# Altium project ET-master.PrjPCB
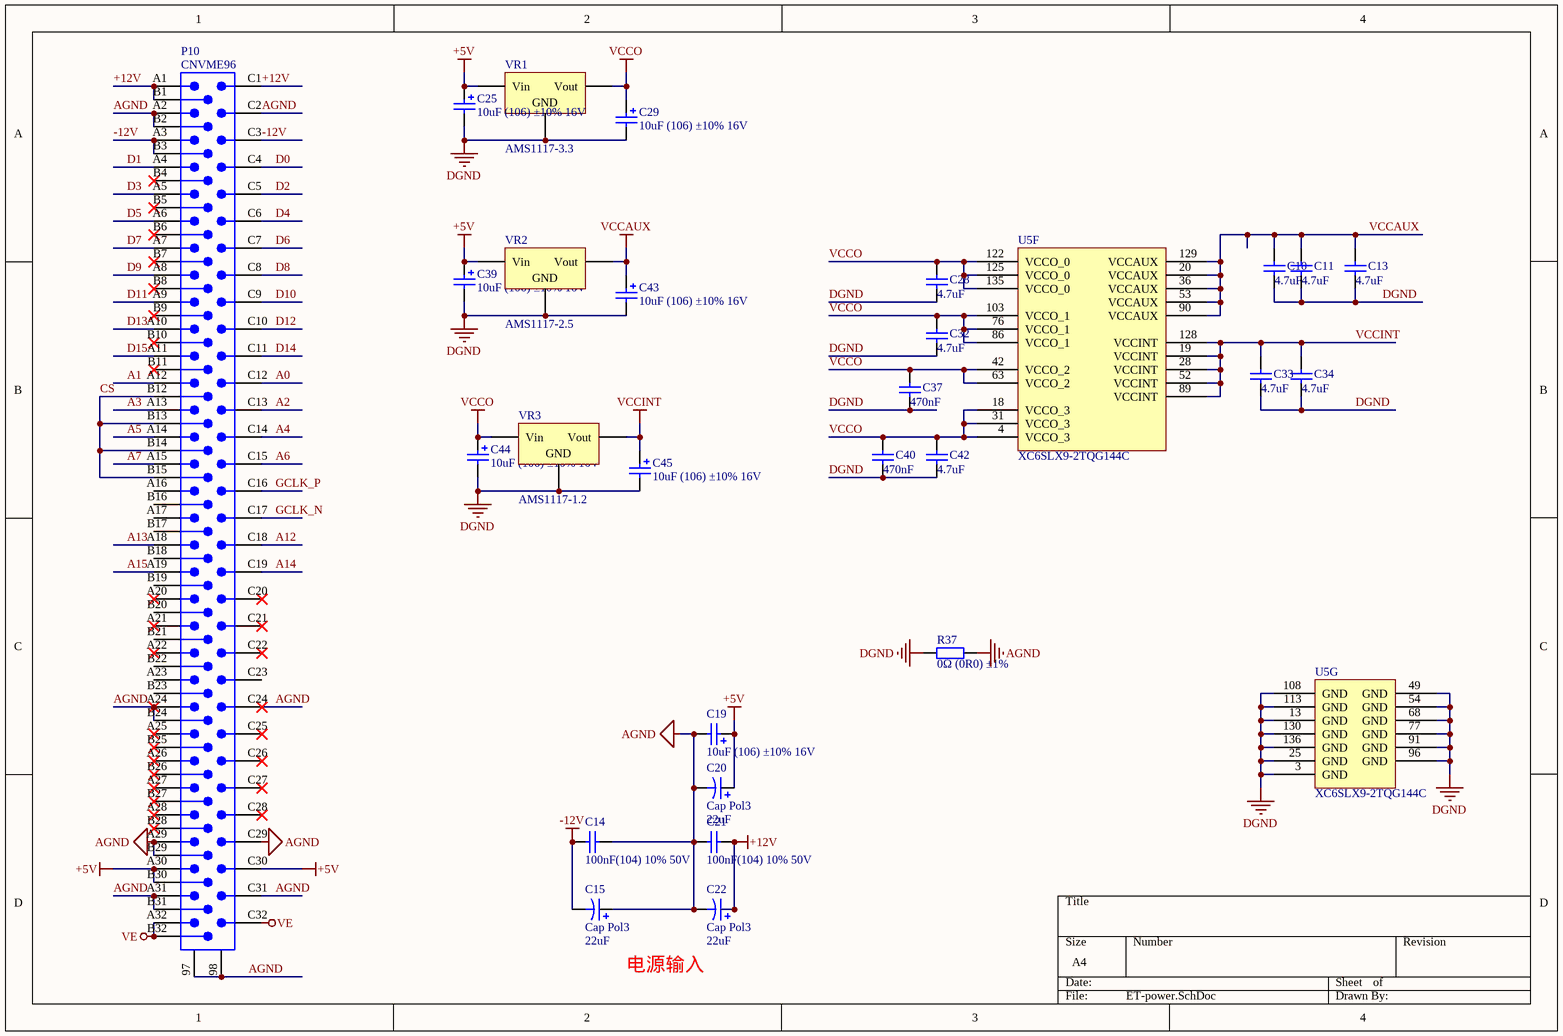
[diagram p0: ET-power.SchDoc]
5 sheets, 88 parts. Net scope: global (net labels, ports and power ports of the same name join across sheets).
Board file: ET-master.PcbDoc
Sheets:
  ET-power.SchDoc
  ET-FPGAIO.SchDoc
  ET-USB.SchDoc
  ET-DAC.SchDoc
  ET-UARTPmod.SchDoc

## Sheet ET-power.SchDoc
size A4

### Parts
C10  4.7uF  [LC-0805_C]
C11  4.7uF  [LC-0805_C]
C13  4.7uF  [LC-0805_C]
C14  100nF(104) 10% 50V  [LC-0805_C]
C15  Cap Pol3  value 22uF  [C2225]
C19  10uF (106) ±10% 16V  [LC-CASE-A_3216]
C20  Cap Pol3  value 22uF  [C2225]
C21  100nF(104) 10% 50V  [LC-0805_C]
C22  Cap Pol3  value 22uF  [C2225]
C25  10uF (106) ±10% 16V  [LC-CASE-A_3216]
C28  4.7uF  [LC-0805_C]
C29  10uF (106) ±10% 16V  [LC-CASE-A_3216]
C32  4.7uF  [LC-0805_C]
C33  4.7uF  [LC-0805_C]
C34  4.7uF  [LC-0805_C]
C37  470nF  [LC-0805_C]
C39  10uF (106) ±10% 16V  [LC-CASE-A_3216]
C40  470nF  [LC-0805_C]
C42  4.7uF  [LC-0805_C]
C43  10uF (106) ±10% 16V  [LC-CASE-A_3216]
C44  10uF (106) ±10% 16V  [LC-CASE-A_3216]
C45  10uF (106) ±10% 16V  [LC-CASE-A_3216]
P10  CNVME96  [CNVME96]
R37  0Ω (0R0) ±1%  [LC-0805_R]
U5  XC6SLX9-2TQG144C  [TQG144_N]  (parts F,G of 7)
VR1  AMS1117-3.3  [LC-SOT-223]
VR2  AMS1117-2.5  [LC-SOT-223]
VR3  AMS1117-1.2  [LC-SOT-223]

### Nets
+5V: C19.1 C20.1 C25.1 C39.1 P10.A30 P10.B30 P10.C30 VR1.3(Vin) VR2.3(Vin)
+12V: C21.2 C22.1 P10.A1 P10.B1 P10.C1
-12V: C14.1 C15.2 P10.A3 P10.B3 P10.C3
AGND: C14.2 C15.1 C19.2 C20.2 C21.1 C22.2 P10.97 P10.98 P10.A2 P10.A24 P10.A29 P10.A31 P10.B2 P10.B24 P10.B29 P10.B31 P10.C2 P10.C24 P10.C29 P10.C31 R37.2
DGND: C10.1 C11.1 C13.1 C25.2 C28.1 C29.2 C32.1 C33.1 C34.1 C37.1 C39.2 C40.1 C42.1 C43.2 C44.2 C45.2 R37.1 U5.3(GND) U5.13(GND) U5.25(GND) U5.49(GND) U5.54(GND) U5.68(GND) U5.77(GND) U5.91(GND) U5.96(GND) U5.108(GND) U5.113(GND) U5.130(GND) U5.136(GND) VR1.1(GND) VR2.1(GND) VR3.1(GND)
VCCAUX: C10.2 C11.2 C13.2 C43.1 U5.20(VCCAUX) U5.36(VCCAUX) U5.53(VCCAUX) U5.90(VCCAUX) U5.129(VCCAUX) VR2.2(Vout)
VCCINT: C33.2 C34.2 C45.1 U5.19(VCCINT) U5.28(VCCINT) U5.52(VCCINT) U5.89(VCCINT) U5.128(VCCINT) VR3.2(Vout)
VCCO: C28.2 C29.1 C32.2 C37.2 C40.2 C42.2 C44.1 U5.4(VCCO_3) U5.18(VCCO_3) U5.31(VCCO_3) U5.42(VCCO_2) U5.63(VCCO_2) U5.76(VCCO_1) U5.86(VCCO_1) U5.103(VCCO_1) U5.122(VCCO_0) U5.125(VCCO_0) U5.135(VCCO_0) VR1.2(Vout) VR3.3(Vin)
VE: P10.A32 P10.B32 P10.C32
A0: P10.C12
A1: P10.A12
A2: P10.C13
A3: P10.A13
A4: P10.C14
A5: P10.A14
A6: P10.C15
A7: P10.A15
A12: P10.C18
A13: P10.A18
A14: P10.C19
A15: P10.A19
CS: P10.B12 P10.B13 P10.B14 P10.B15
D0: P10.C4
D1: P10.A4
D2: P10.C5
D3: P10.A5
D4: P10.C6
D5: P10.A6
D6: P10.C7
D7: P10.A7
D8: P10.C8
D9: P10.A8
D10: P10.C9
D11: P10.A9
D12: P10.C10
D13: P10.A10
D14: P10.C11
D15: P10.A11
GCLK_N: P10.C17
GCLK_P: P10.C16

Not connected (* = marked no-connect by the designer): P10 A16 A17 A20* A21* A22* A23 A25* A26* A27* A28* B4* B5* B6* B7* B8* B9* B10* B11* B16 B17 B18 B19 B20 B21 B22 B23 B25* B26* B27* B28* C20* C21* C22* C23 C25* C26* C27* C28*

### Notes on the sheet
- 电源输入

### Library data of the parts
C10 C11 C13 C28 C32-C34 C42 = 0805 4.7uF (475) 10% 25V: 贴片电容; ComponentLink1Description: 供应商链接; ComponentLink1URL: http://www.szlcsc.com/product/details_2131.html; Package: 0805; Supplier: LC; SuppliersPartNumber: C1779
C14 C21 = 0805 100nF(104) 10% 50V: 贴片电容; ComponentLink1Description: 供应商链接; ComponentLink1URL: http://www.szlcsc.com/product/details_50686.html; Package: 0805; Supplier: LC; SuppliersPartNumber: C49678
C15 C20 C22 = Cap Pol3: Polarized Capacitor (Surface Mount); Published: 8-Jun-2000; LatestRevisionDate: 29-May-2009; LatestRevisionNote: IPC-7351 Footprint Added.; PackageReference: C0805; Publisher: Altium Limited; PackageDescription: Chip Capacitor
C19 C25 C29 C39 C43-C45 = 3216 10uF (106) 10% 16V: 钽电容; ComponentLink1Description: 供应商链接; ComponentLink1URL: http://www.szlcsc.com/product/details_7643.html; Package: 3216; Supplier: LC; SuppliersPartNumber: C7171
C37 C40 = 0805 470nF (474) 10% 50V: 贴片电容; ComponentLink1Description: 供应商链接; ComponentLink1URL: http://www.szlcsc.com/product/details_14623.html; Package: 0805; Supplier: LC; SuppliersPartNumber: C13967
P10 = CNVME96: 96-Pin Connector (3x32 2.54mm grid); Text Field6: Alternate Layout Available; Text Field7: Published 14-Feb-2002
R37 = 0805 0Ω (0R0) 1%: 贴片电阻; ComponentLink1Description: 供应商链接; ComponentLink1URL: http://www.szlcsc.com/product/details_18165.html; Package: 0805; Supplier: LC; SuppliersPartNumber: C17477
U5 = XC6SLX9-2TQG144C: Spartan-6 LX 1.2V FPGA, 102 User I/Os, 144-Pin TQFP (0.5mm Pitch), Speed Grade 2, Commercial Grade, Pb-Free; Published: 17-Nov-2009; DatasheetVersion: ver1.6, Nov-2010; PackageVersion: ver1.2, Jun-2004; PackageReference: TQG144; Publisher: Altium Limited; PackageDescription: 144-Pin Thin Quad Flat Pack (TQG144) - Pb-Free; Supplier 1: Digi-Key; Supplier Part Number 1: XC6SLX9-2TQG144C-ND; Code_JEDEC: MS-026-BFB; ComponentLink1Description: Manufacturer Link; ComponentLink1URL: http://www.xilinx.com; ComponentLink2Description: Spartan-6 Datasheet; ComponentLink2URL: http://www.xilinx.com/support/documentation/data_sheets/ds160.pdf; ComponentLink3Description: Spartan-6 Documents; ComponentLink3URL: http://www.xilinx.com/support/documentation/spartan-6.htm; ComponentLink4Description: Xilinx.com Home; ComponentLink4URL: http://www.xilinx.com
VR1 = SOT-223 AMS1117-3.3: 低压差线性稳压(LDO); ComponentLink1Description: 供应商链接; ComponentLink1URL: http://www.szlcsc.com/product/details_6652.html; Package: SOT-223; Supplier: LC; SuppliersPartNumber: C6186
VR2 = SOT-223 AMS1117-2.5: 低压差线性稳压(LDO); ComponentLink1Description: 供应商链接; ComponentLink1URL: http://www.szlcsc.com/product/details_6652.html; Package: SOT-223; Supplier: LC; SuppliersPartNumber: C6186
VR3 = SOT-223 AMS1117-1.2: 低压差线性稳压(LDO); ComponentLink1Description: 供应商链接; ComponentLink1URL: http://www.szlcsc.com/product/details_6652.html; Package: SOT-223; Supplier: LC; SuppliersPartNumber: C6186

## Sheet ET-FPGAIO.SchDoc
size A4
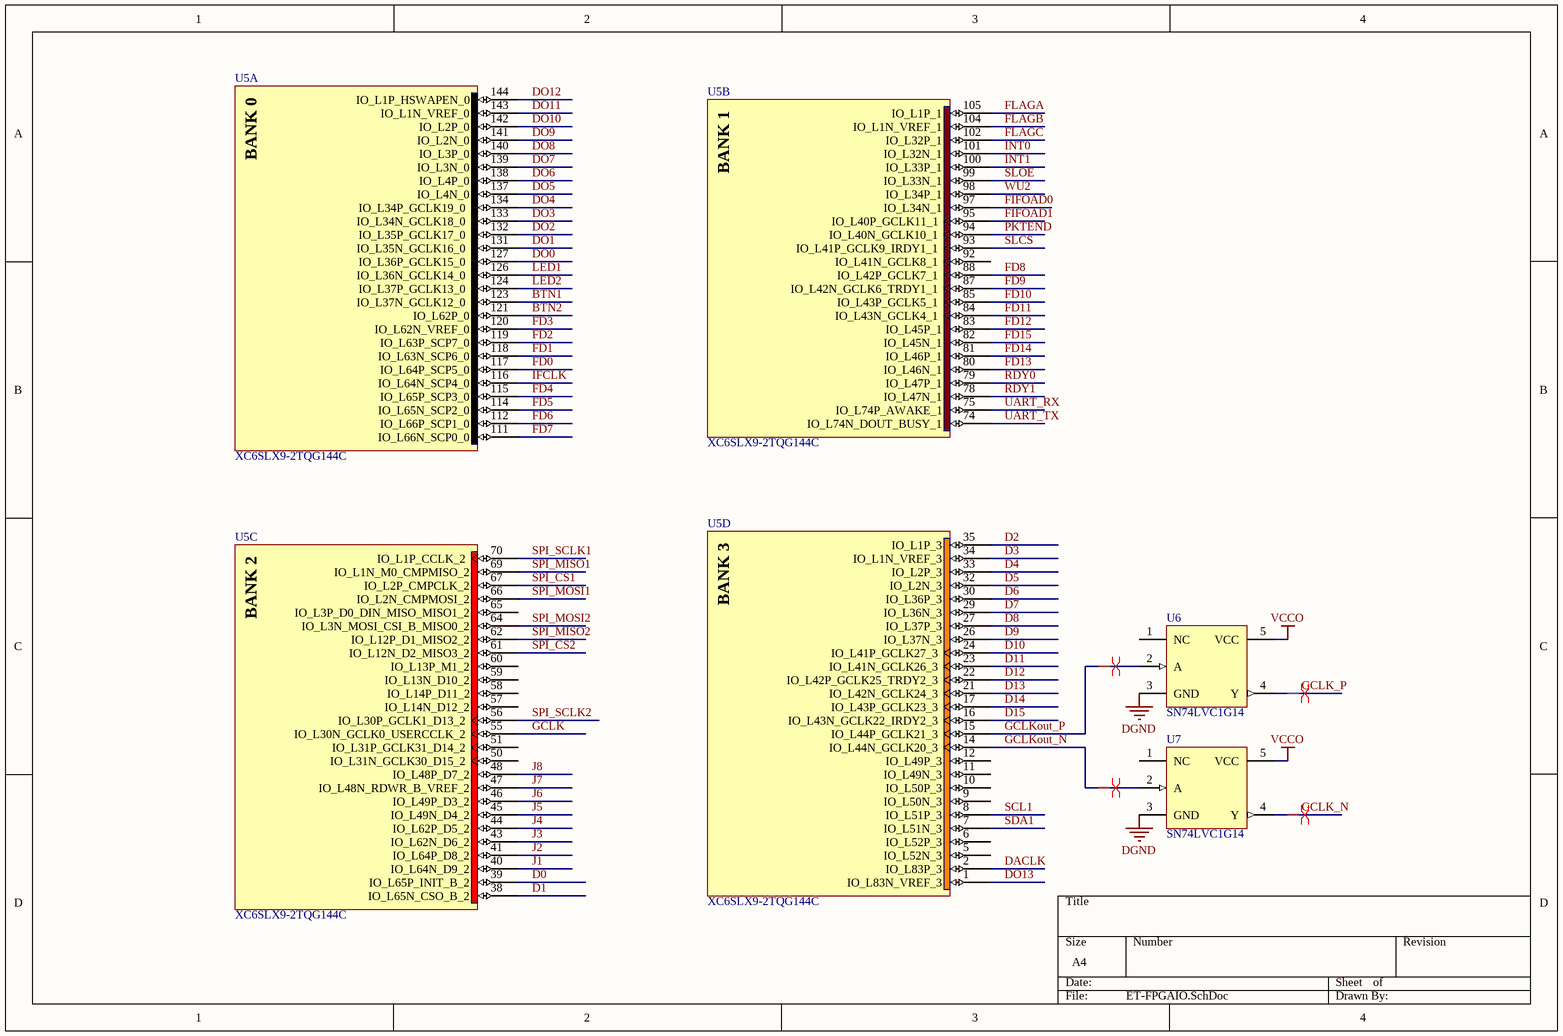
[diagram p1: ET-FPGAIO.SchDoc]

### Parts
U5  XC6SLX9-2TQG144C  [TQG144_N]  (parts A,B,C,D of 7)
U6  SN74LVC1G14  [SOT-23-5]
U7  SN74LVC1G14  [SOT-23-5]

### Nets
DGND: U6.3(GND) U7.3(GND)
VCCO: U6.5(VCC) U7.5(VCC)
~{INT0}: U5.101(IO_L32N_1)
~{INT1}: U5.100(IO_L33P_1)
~{SLCS}: U5.93(IO_L41P_GCLK9_IRDY1_1)
BTN1: U5.123(IO_L37N_GCLK12_0)
BTN2: U5.121(IO_L62P_0)
D0: U5.39(IO_L65P_INIT_B_2)
D1: U5.38(IO_L65N_CSO_B_2)
D2: U5.35(IO_L1P_3)
D3: U5.34(IO_L1N_VREF_3)
D4: U5.33(IO_L2P_3)
D5: U5.32(IO_L2N_3)
D6: U5.30(IO_L36P_3)
D7: U5.29(IO_L36N_3)
D8: U5.27(IO_L37P_3)
D9: U5.26(IO_L37N_3)
D10: U5.24(IO_L41P_GCLK27_3)
D11: U5.23(IO_L41N_GCLK26_3)
D12: U5.22(IO_L42P_GCLK25_TRDY2_3)
D13: U5.21(IO_L42N_GCLK24_3)
D14: U5.17(IO_L43P_GCLK23_3)
D15: U5.16(IO_L43N_GCLK22_IRDY2_3)
DACLK: U5.2(IO_L83P_3)
DO0: U5.127(IO_L36P_GCLK15_0)
DO1: U5.131(IO_L35N_GCLK16_0)
DO2: U5.132(IO_L35P_GCLK17_0)
DO3: U5.133(IO_L34N_GCLK18_0)
DO4: U5.134(IO_L34P_GCLK19_0)
DO5: U5.137(IO_L4N_0)
DO6: U5.138(IO_L4P_0)
DO7: U5.139(IO_L3N_0)
DO8: U5.140(IO_L3P_0)
DO9: U5.141(IO_L2N_0)
DO10: U5.142(IO_L2P_0)
DO11: U5.143(IO_L1N_VREF_0)
DO12: U5.144(IO_L1P_HSWAPEN_0)
DO13: U5.1(IO_L83N_VREF_3)
FD0: U5.117(IO_L64P_SCP5_0)
FD1: U5.118(IO_L63N_SCP6_0)
FD2: U5.119(IO_L63P_SCP7_0)
FD3: U5.120(IO_L62N_VREF_0)
FD4: U5.115(IO_L65P_SCP3_0)
FD5: U5.114(IO_L65N_SCP2_0)
FD6: U5.112(IO_L66P_SCP1_0)
FD7: U5.111(IO_L66N_SCP0_0)
FD8: U5.88(IO_L42P_GCLK7_1)
FD9: U5.87(IO_L42N_GCLK6_TRDY1_1)
FD10: U5.85(IO_L43P_GCLK5_1)
FD11: U5.84(IO_L43N_GCLK4_1)
FD12: U5.83(IO_L45P_1)
FD13: U5.80(IO_L46N_1)
FD14: U5.81(IO_L46P_1)
FD15: U5.82(IO_L45N_1)
FIFOAD0: U5.97(IO_L34N_1)
FIFOAD1: U5.95(IO_L40P_GCLK11_1)
FLAGA: U5.105(IO_L1P_1)
FLAGB: U5.104(IO_L1N_VREF_1)
FLAGC: U5.102(IO_L32P_1)
GCLK: U5.55(IO_L30N_GCLK0_USERCCLK_2)
GCLK_N: U7.4(Y)
GCLK_P: U6.4(Y)
GCLKout_N: U5.14(IO_L44N_GCLK20_3) U7.2(A)
GCLKout_P: U5.15(IO_L44P_GCLK21_3) U6.2(A)
IFCLK: U5.116(IO_L64N_SCP4_0)
J1: U5.40(IO_L64N_D9_2)
J2: U5.41(IO_L64P_D8_2)
J3: U5.43(IO_L62N_D6_2)
J4: U5.44(IO_L62P_D5_2)
J5: U5.45(IO_L49N_D4_2)
J6: U5.46(IO_L49P_D3_2)
J7: U5.47(IO_L48N_RDWR_B_VREF_2)
J8: U5.48(IO_L48P_D7_2)
LED1: U5.126(IO_L36N_GCLK14_0)
LED2: U5.124(IO_L37P_GCLK13_0)
PKTEND: U5.94(IO_L40N_GCLK10_1)
RDY0: U5.79(IO_L47P_1)
RDY1: U5.78(IO_L47N_1)
SCL1: U5.8(IO_L51P_3)
SDA1: U5.7(IO_L51N_3)
SLOE: U5.99(IO_L33N_1)
SPI_CS1: U5.67(IO_L2P_CMPCLK_2)
SPI_CS2: U5.61(IO_L12N_D2_MISO3_2)
SPI_MISO1: U5.69(IO_L1N_M0_CMPMISO_2)
SPI_MISO2: U5.62(IO_L12P_D1_MISO2_2)
SPI_MOSI1: U5.66(IO_L2N_CMPMOSI_2)
SPI_MOSI2: U5.64(IO_L3N_MOSI_CSI_B_MISO0_2)
SPI_SCLK1: U5.70(IO_L1P_CCLK_2)
SPI_SCLK2: U5.56(IO_L30P_GCLK1_D13_2)
UART_RX: U5.75(IO_L74P_AWAKE_1)
UART_TX: U5.74(IO_L74N_DOUT_BUSY_1)
WU2: U5.98(IO_L34P_1)

Not connected (* = marked no-connect by the designer): U5 5(IO_L52N_3) 6(IO_L52P_3) 9(IO_L50N_3) 10(IO_L50P_3) 11(IO_L49N_3) 12(IO_L49P_3) 50(IO_L31N_GCLK30_D15_2) 51(IO_L31P_GCLK31_D14_2) 57(IO_L14N_D12_2) 58(IO_L14P_D11_2) 59(IO_L13N_D10_2) 60(IO_L13P_M1_2) 65(IO_L3P_D0_DIN_MISO_MISO1_2) 92(IO_L41N_GCLK8_1); U6 1(NC); U7 1(NC)

### Layout directives
differential pair: GCLK_N, GCLK_P, GCLKout_N, GCLKout_P

### Notes on the sheet
- (in symbol XC6SLX9-2TQG144C, part A) BANK 0
- (in symbol XC6SLX9-2TQG144C, part B) BANK 1
- (in symbol XC6SLX9-2TQG144C, part C) BANK 2
- (in symbol XC6SLX9-2TQG144C, part D) BANK 3

### Library data of the parts
U5 = XC6SLX9-2TQG144C: as U5 on sheet ET-power; Published: 17-Nov-2009; DatasheetVersion: ver1.6, Nov-2010; PackageVersion: ver1.2, Jun-2004; PackageReference: TQG144; Publisher: Altium Limited; PackageDescription: 144-Pin Thin Quad Flat Pack (TQG144) - Pb-Free; Supplier 1: Digi-Key; Supplier Part Number 1: XC6SLX9-2TQG144C-ND; Code_JEDEC: MS-026-BFB; ComponentLink1Description: Manufacturer Link; ComponentLink1URL: http://www.xilinx.com; ComponentLink2Description: Spartan-6 Datasheet; ComponentLink2URL: http://www.xilinx.com/support/documentation/data_sheets/ds160.pdf; ComponentLink3Description: Spartan-6 Documents; ComponentLink3URL: http://www.xilinx.com/support/documentation/spartan-6.htm; ComponentLink4Description: Xilinx.com Home; ComponentLink4URL: http://www.xilinx.com

## Sheet ET-USB.SchDoc
size A4
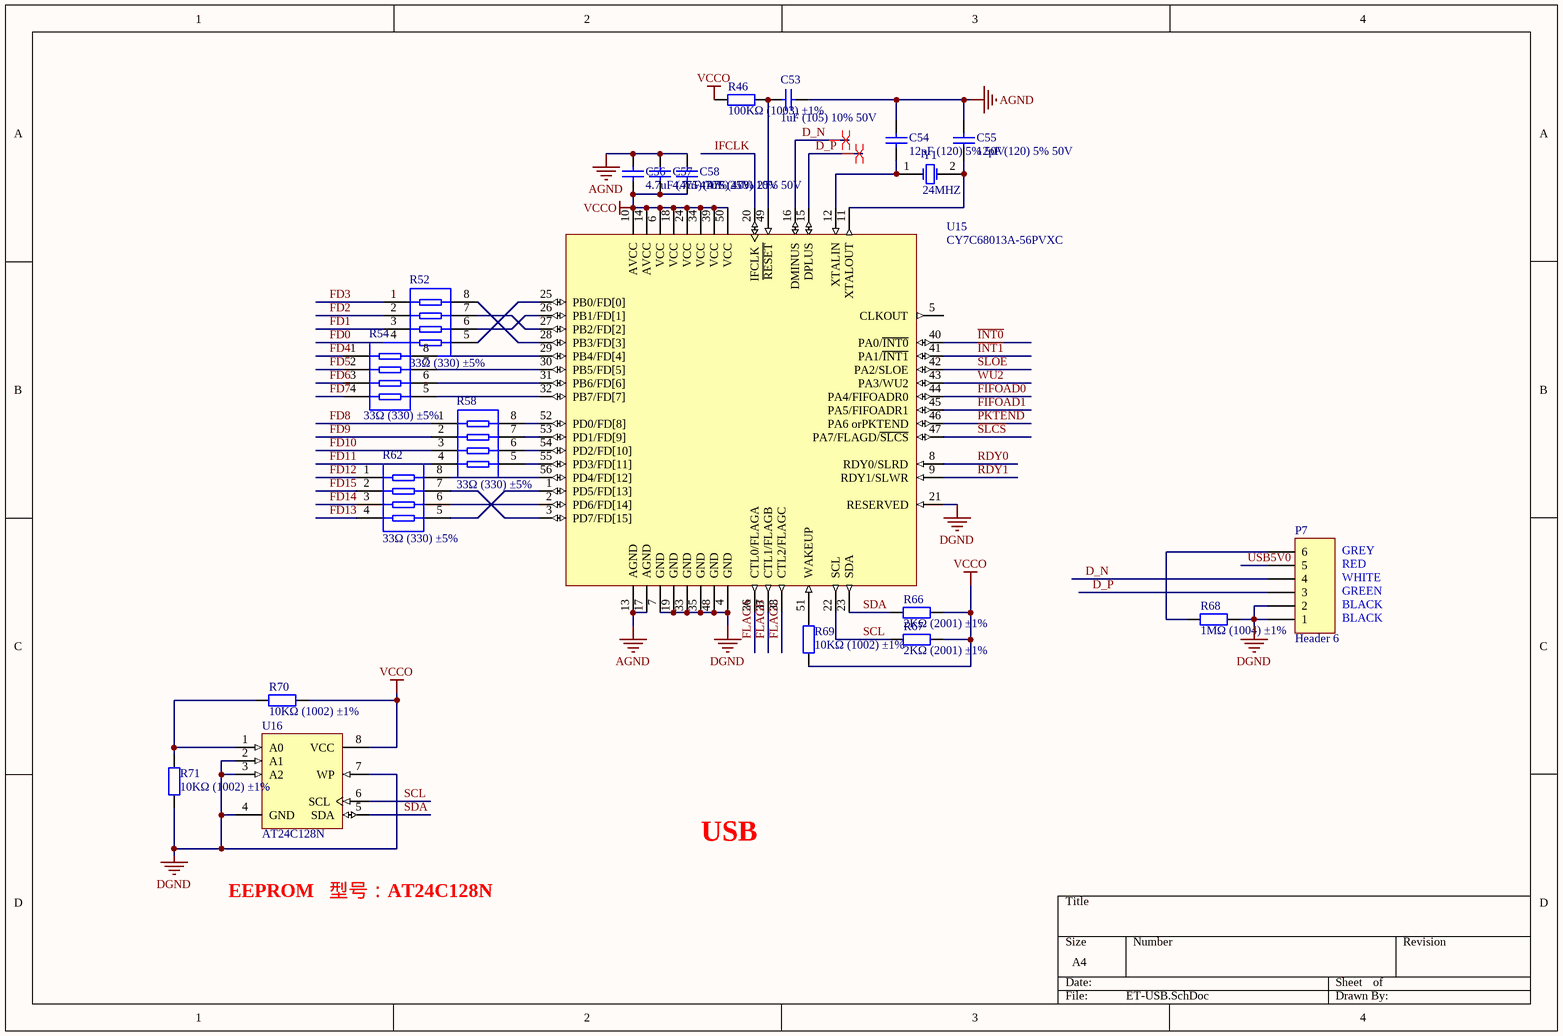
[diagram p2: ET-USB.SchDoc]

### Parts
C53  1uF (105) 10% 50V  [LC-0805_C]
C54  12pF (120) 5% 50V  [LC-0805_C]
C55  12pF (120) 5% 50V  [LC-0805_C]
C56  4.7uF (475) 10% 25V  [LC-0805_C]
C57  4.7uF (475) 10% 25V  [LC-0805_C]
C58  47nF (473) 10% 50V  [LC-0805_C]
P7  Header 6  [HDR1X6]
R46  100KΩ (1003) ±1%  [LC-0805_R]
R52  33Ω (330) ±5%  [LC-0402_Rx4]
R54  33Ω (330) ±5%  [LC-0402_Rx4]
R58  33Ω (330) ±5%  [LC-0402_Rx4]
R62  33Ω (330) ±5%  [LC-0402_Rx4]
R66  2KΩ (2001) ±1%  [LC-0805_R]
R67  2KΩ (2001) ±1%  [LC-0805_R]
R68  1MΩ (1004) ±1%  [LC-0805_R]
R69  10KΩ (1002) ±1%  [LC-0805_R]
R70  10KΩ (1002) ±1%  [LC-0805_R]
R71  10KΩ (1002) ±1%  [LC-0805_R]
U15  CY7C68013A-56PVXC  [O56_N]
U16  AT24C128N  [8P3]
Y1  24MHZ  [XTAL5]

### Nets
AGND: C53.2 C54.2 C55.2 C56.2 C57.2 C58.2 U15.13(AGND) U15.17(AGND)
DGND: P7.1 P7.2 R68.2 R71.1 U15.4(GND) U15.7(GND) U15.19(GND) U15.21(RESERVED) U15.33(GND) U15.35(GND) U15.48(GND) U16.2(A1) U16.3(A2) U16.4(GND) U16.7(WP)
VCCO: C56.1 C57.1 C58.1 R46.1 R66.2 R67.2 R69.1 R70.2 U15.6(VCC) U15.10(AVCC) U15.14(AVCC) U15.18(VCC) U15.24(VCC) U15.34(VCC) U15.39(VCC) U15.50(VCC) U16.8(VCC)
~{INT0}: U15.40(PA0/~{INT0})
~{INT1}: U15.41(PA1/~{INT1})
~{SLCS}: U15.47(PA7/FLAGD/~{SLCS})
D_N: P7.4 U15.16(DMINUS)
D_P: P7.3 U15.15(DPLUS)
FD0: R52.4
FD1: R52.3
FD2: R52.2
FD3: R52.1
FD4: R54.1
FD5: R54.2
FD6: R54.3
FD7: R54.4
FD8: R58.1
FD9: R58.2
FD10: R58.3
FD11: R58.4
FD12: R62.1
FD13: R62.4
FD14: R62.3
FD15: R62.2
FIFOAD0: U15.44(PA4/FIFOADR0)
FIFOAD1: U15.45(PA5/FIFOADR1)
FLAGA: U15.36(CTL0/FLAGA)
FLAGB: U15.37(CTL1/FLAGB)
FLAGC: U15.38(CTL2/FLAGC)
IFCLK: U15.20(IFCLK)
PKTEND: U15.46(PA6_orPKTEND)
RDY0: U15.8(RDY0/SLRD)
RDY1: U15.9(RDY1/SLWR)
SCL: R67.1 U15.22(SCL) U16.6(SCL)
SDA: R66.1 U15.23(SDA) U16.5(SDA)
SLOE: U15.42(PA2/SLOE)
USB5V0: P7.5
WU2: U15.43(PA3/WU2)
NetC53_1: C53.1 R46.2 U15.49(~{RESET})
NetC54_1: C54.1 U15.12(XTALIN) Y1.1(OSC1)
NetC55_1: C55.1 U15.11(XTALOUT) Y1.2(OSC2)
NetP7_6: P7.6 R68.1
NetR52_5: R52.5 U15.25(PB0/FD[0])
NetR52_6: R52.6 U15.26(PB1/FD[1])
NetR52_7: R52.7 U15.27(PB2/FD[2])
NetR52_8: R52.8 U15.28(PB3/FD[3])
NetR54_5: R54.5 U15.32(PB7/FD[7])
NetR54_6: R54.6 U15.31(PB6/FD[6])
NetR54_7: R54.7 U15.30(PB5/FD[5])
NetR54_8: R54.8 U15.29(PB4/FD[4])
NetR58_5: R58.5 U15.55(PD3/FD[11])
NetR58_6: R58.6 U15.54(PD2/FD[10])
NetR58_7: R58.7 U15.53(PD1/FD[9])
NetR58_8: R58.8 U15.52(PD0/FD[8])
NetR62_5: R62.5 U15.1(PD5/FD[13])
NetR62_6: R62.6 U15.2(PD6/FD[14])
NetR62_7: R62.7 U15.3(PD7/FD[15])
NetR62_8: R62.8 U15.56(PD4/FD[12])
NetR69_2: R69.2 U15.51(WAKEUP)
NetR70_1: R70.1 R71.2 U16.1(A0)

Not connected (* = marked no-connect by the designer): U15 5(CLKOUT)

### Layout directives
differential pair: D_N, D_P

### Notes on the sheet
- USB
- EEPROM   型号：AT24C128N
- Labels drawn without touching a wire or pin: BLACK, GREEN, GREY, RED, WHITE

### Library data of the parts
C53 = 0805 1uF (105) 10% 50V: 贴片电容; ComponentLink1Description: 供应商链接; ComponentLink1URL: http://www.szlcsc.com/product/details_29074.html; Package: 0805; Supplier: LC; SuppliersPartNumber: C28323
C54 C55 = 0805 12pF (120) 5% 50V: 贴片电容; ComponentLink1Description: 供应商链接; ComponentLink1URL: http://www.szlcsc.com/product/details_2144.html; Package: 0805; Supplier: LC; SuppliersPartNumber: C1792
C56 C57 = 0805 4.7uF (475) 10% 25V: 贴片电容; ComponentLink1Description: 供应商链接; ComponentLink1URL: http://www.szlcsc.com/product/details_2131.html; Package: 0805; Supplier: LC; SuppliersPartNumber: C1779
C58 = 0805 47nF (473) 10% 50V: 贴片电容; ComponentLink1Description: 供应商链接; ComponentLink1URL: http://www.szlcsc.com/product/details_54150.html; Package: 0805; Supplier: LC; SuppliersPartNumber: C53134
P7 = Header 6: Header, 6-Pin; LatestRevisionDate: 17-Jul-2002; LatestRevisionNote: Re-released for DXP Platform.; Publisher: Altium Limited
R46 = 0805 100KΩ (1003) 1%: 贴片电阻; ComponentLink1Description: 供应商链接; ComponentLink1URL: http://www.szlcsc.com/product/details_18095.html; Package: 0805; Supplier: LC; SuppliersPartNumber: C17407
R52 R54 R58 R62 = 0402*4 33Ω (330) 5%: 贴片排阻; ComponentLink1Description: 供应商链接; ComponentLink1URL: http://www.szlcsc.com/product/details_26244.html; Package: 0402*4; Supplier: LC; SuppliersPartNumber: C25501
R66 R67 = 0805 2KΩ (2001) 1%: 贴片电阻; ComponentLink1Description: 供应商链接; ComponentLink1URL: http://www.szlcsc.com/product/details_18292.html; Package: 0805; Supplier: LC; SuppliersPartNumber: C17604
R68 = 0805 1MΩ (1004) 1%: 贴片电阻; ComponentLink1Description: 供应商链接; ComponentLink1URL: http://www.szlcsc.com/product/details_18202.html; Package: 0805; Supplier: LC; SuppliersPartNumber: C17514
R69-R71 = 0805 10KΩ (1002) 1%: 贴片电阻; ComponentLink1Description: 供应商链接; ComponentLink1URL: http://www.szlcsc.com/product/details_18102.html; Package: 0805; Supplier: LC; SuppliersPartNumber: C17414
U15 = CY7C68013A-56PVXC: EZ-USB FX2LP USB Microcontroller Ideal for Non-Battery Powered Applications,16K RAM, 24 I/Os, 56-Pin SSOP, Pb-Free, Commercial Grade; Published: 16-Dec-2005; LatestRevisionDate: 20-Nov-2009; LatestRevisionNote: IPC-7351 Footprint Added.; DatasheetVersion: rev.J, Sep-2005; PackageVersion: Feb-2005; PackageReference: O56; Publisher: Altium Limited; PackageDescription: 56-Pin Small Outline Package 0.635 mm Pitch; Code_JEDEC: MO-118-AB; Code_IPC: SOP635P1035-56; ComponentLink1Description: Manufacturer Link; ComponentLink1URL: http://www.cypress.com/portal/server.pt; ComponentLink2Description: Datasheet; ComponentLink2URL: http://www.cypress.com/portal/server.pt/gateway/PTARGS_0_2_1524_209_259_43/http%3B/sjapp20.mis.cypress.com%3B7001/publishedcontent/publish/design_resources/datasheets/contents/cy7c68013a_5.pdf
U16 = AT24C01BN-SP25-B: 1Kbit (128 x 8), 2-wire Bus Automotive Serial EEPROM with Write Protect, 2.5V, 8-Pin SOIC, Bulk; Published: 20-Sep-2010; DatasheetVersion: 8517C,  Jan-2009; PackageVersion: revC, Mar-2005; PackageReference: 8S1; Publisher: Altium Limited; PackageDescription: 8-Lead (0.150" Wide Body), Plastic Gull Wing Small Outline (JEDEC SOIC); Code_JEDEC: MS-012-AA; Code_IPC: SOIC127P600-8; ComponentLink1Description: Manufacturer Link; ComponentLink1URL: http://www.atmel.com/products/serial/default.asp; ComponentLink2Description: Datasheet; ComponentLink2URL: http://www.atmel.com/dyn/resources/prod_documents/doc8517.pdf; ComponentLink3Description: Atmel.com Home; ComponentLink3URL: http://www.atmel.com
Y1 = XTAL: Crystal Oscillator; Published: 8-Jun-2000; LatestRevisionDate: 17-Jul-2002; LatestRevisionNote: Re-released for DXP Platform.; PackageReference: R38; Publisher: Altium Limited

## Sheet ET-DAC.SchDoc
size A4
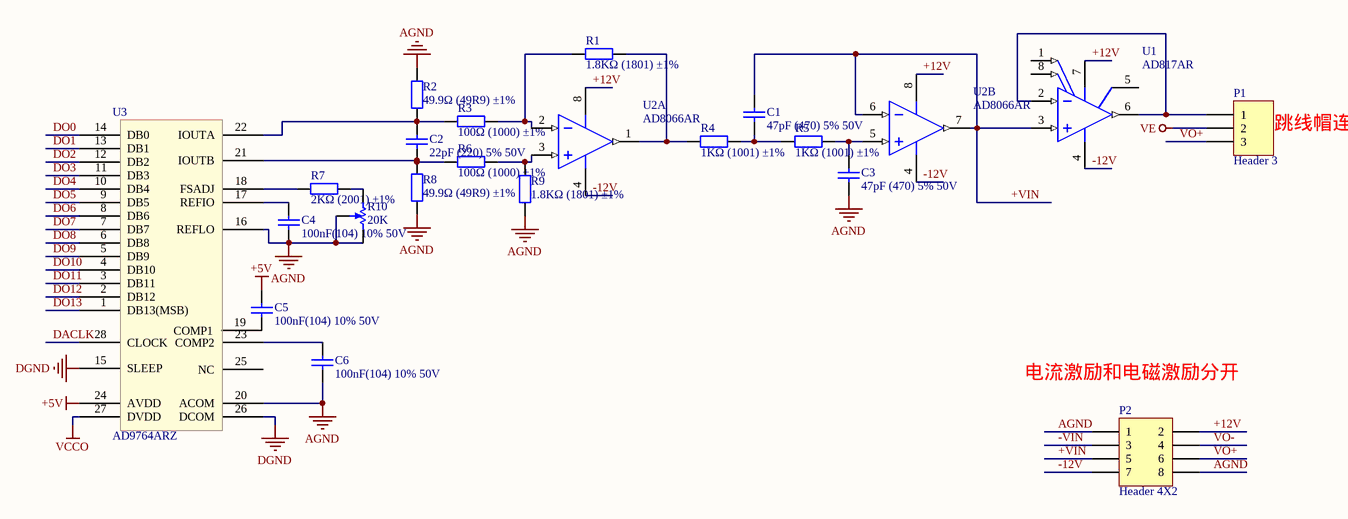
[diagram p3: ET-DAC.SchDoc]

### Parts
C1  47pF (470) 5% 50V  [LC-0805_C]
C2  22pF (220) 5% 50V  [LC-0805_C]
C3  47pF (470) 5% 50V  [LC-0805_C]
C4  100nF(104) 10% 50V  [LC-0805_C]
C5  100nF(104) 10% 50V  [LC-0805_C]
C6  100nF(104) 10% 50V  [LC-0805_C]
P1  Header 3  [HDR1X3]
P2  Header 4X2  [HDR2X4]
R1  1.8KΩ (1801) ±1%  [LC-0805_R]
R2  49.9Ω (49R9) ±1%  [LC-0805_R]
R3  100Ω (1000) ±1%  [LC-0805_R]
R4  1KΩ (1001) ±1%  [LC-0805_R]
R5  1KΩ (1001) ±1%  [LC-0805_R]
R6  100Ω (1000) ±1%  [LC-0805_R]
R7  2KΩ (2001) ±1%  [LC-0805_R]
R8  49.9Ω (49R9) ±1%  [LC-0805_R]
R9  1.8KΩ (1801) ±1%  [LC-0805_R]
R10  20K  [POT4MM-2]
U1  AD817AR  [ADI-R-8_N]
U2  AD8066AR  [ADI-R-8_N]  (parts A,B of 2)
U3  AD9764ARZ  [RW_28]

### Nets
+5V: C5.2 U3.24(AVDD)
+12V: P2.2 U1.7(+VS) U2.8(+VS)
-12V: P2.7 U1.4(-VS) U2.4(-VS)
AGND: C3.2 C4.1 C6.1 P2.1 P2.8 R2.2 R8.1 R9.1 R10.CW(+) R10.W U3.16(REFLO) U3.20(ACOM)
DGND: U3.15(SLEEP) U3.26(DCOM)
VCCO: U3.27(DVDD)
VE: P1.2
+VIN: C1.2 P2.5 U1.3(+IN) U2.6(-IN_2) U2.7(VOUT_2)
-VIN: P2.3
DACLK: U3.28(CLOCK)
DO0: U3.14(DB0)
DO1: U3.13(DB1)
DO2: U3.12(DB2)
DO3: U3.11(DB3)
DO4: U3.10(DB4)
DO5: U3.9(DB5)
DO6: U3.8(DB6)
DO7: U3.7(DB7)
DO8: U3.6(DB8)
DO9: U3.5(DB9)
DO10: U3.4(DB10)
DO11: U3.3(DB11)
DO12: U3.2(DB12)
DO13: U3.1(DB13(MSB))
VO+: P1.3 P2.6
VO-: P2.4
NetC1_1: C1.1 R4.2 R5.2
NetC2_1: C2.1 R6.1 R8.2 U3.21(IOUTB)
NetC2_2: C2.2 R2.1 R3.1 U3.22(IOUTA)
NetC3_1: C3.1 R5.1 U2.5(+IN_2)
NetC4_2: C4.2 U3.17(REFIO)
NetC5_1: C5.1 U3.19(COMP1)
NetC6_2: C6.2 U3.23(COMP2)
NetP1_1: P1.1 U1.2(-IN) U1.6(OUT)
NetR1_1: R1.1 R3.2 U2.2(-IN_1)
NetR1_2: R1.2 R4.1 U2.1(VOUT_1)
NetR6_2: R6.2 R9.2 U2.3(+IN_1)
NetR7_1: R7.1 U3.18(FSADJ)
NetR7_2: R7.2 R10.CCW(-)

Not connected (* = marked no-connect by the designer): U1 1(NULL) 5(NC) 8(NULL); U3 25(NC)

### Notes on the sheet
- (near P1) 跳线帽连接
- (near P2) 电流激励和电磁激励分开

### Library data of the parts
C1 C3 = 0805 47pF (470) 5% 50V: 贴片电容; ComponentLink1Description: 供应商链接; ComponentLink1URL: http://www.szlcsc.com/product/details_15529.html; Package: 0805; Supplier: LC; SuppliersPartNumber: C14857
C2 = 0805 22pF (220) 5% 50V: 贴片电容; ComponentLink1Description: 供应商链接; ComponentLink1URL: http://www.szlcsc.com/product/details_2156.html; Package: 0805; Supplier: LC; SuppliersPartNumber: C1804
C4-C6 = 0805 100nF(104) 10% 50V: 贴片电容; ComponentLink1Description: 供应商链接; ComponentLink1URL: http://www.szlcsc.com/product/details_50686.html; Package: 0805; Supplier: LC; SuppliersPartNumber: C49678
P1 = Header 3: Header, 3-Pin; LatestRevisionDate: 17-Jul-2002; LatestRevisionNote: Re-released for DXP Platform.; Publisher: Altium Limited
P2 = Header 4X2: Header, 4-Pin, Dual row; LatestRevisionDate: 17-Jul-2002; LatestRevisionNote: Re-released for DXP Platform.; Publisher: Altium Limited
R1 R9 = 0805 1.8KΩ (1801) 1%: 贴片电阻; ComponentLink1Description: 供应商链接; ComponentLink1URL: http://www.szlcsc.com/product/details_18086.html; Package: 0805; Supplier: LC; SuppliersPartNumber: C17398
R2 R8 = 0805 49.9Ω (49R9) 1%: 贴片电阻; ComponentLink1Description: 供应商链接; ComponentLink1URL: http://www.szlcsc.com/product/details_18408.html; Package: 0805; Supplier: LC; SuppliersPartNumber: C17720
R3 R6 = 0805 100Ω (1000) 1%: 贴片电阻; ComponentLink1Description: 供应商链接; ComponentLink1URL: http://www.szlcsc.com/product/details_18096.html; Package: 0805; Supplier: LC; SuppliersPartNumber: C17408
R4 R5 = 0805 1KΩ (1001) 1%: 贴片电阻; ComponentLink1Description: 供应商链接; ComponentLink1URL: http://www.szlcsc.com/product/details_18201.html; Package: 0805; Supplier: LC; SuppliersPartNumber: C17513
R7 = 0805 2KΩ (2001) 1%: 贴片电阻; ComponentLink1Description: 供应商链接; ComponentLink1URL: http://www.szlcsc.com/product/details_18292.html; Package: 0805; Supplier: LC; SuppliersPartNumber: C17604
R10 = RPot SM: Square Trimming Potentiometer; Published: 17-Dec-2003; DatasheetVersion: Oct-2003; PackageReference: POT4MM-2; Publisher: Altium Limited; PackageDescription: Square Trimming Potentiometer; ComponentLink1Description: Manufacturer Link; ComponentLink1URL: http://bourns.com/2/search.html
U1 = AD817AR: Single Channel Low Power Operational Amplifier, 50 MHz BW, 350 V/us SR, Industrial, 8-pin SOIC (R-8), Tube; Generic Part Number: AD817; Manufacturer: Analog Devices; Amplifiers Per Package: 1; Input Bias Current: 3.3uA; Input Offset Voltage: 500uV; Iq/Amp: 7.5mA; Small Signal Bandwidth: 50MHz; V Span Max: 36V; V Span Min: 5V; DatasheetVersion: Rev. B; PackageVersion: 060506-A; PackageReference: R-8; PackageDescription: 8-Pin Standard Small Outline Package, Body 3.9 x 4.9 mm, Pitch 1.27 mm; Supplier 1: Digi-Key; Supplier Part Number 1: AD817AR-ND; Slew Rate: 350V/us; Mounting Technology: Surface Mount; Code_JEDEC: MS-012-AA; PartNumber: AD817AR; ComponentLink1Description: Manufacturer URL; ComponentLink1URL: http://www.analog.com/en/index.html; ComponentLink2Description: Datasheet; ComponentLink2URL: http://www.analog.com/static/imported-files/data_sheets/AD817.pdf; ComponentLink3Description: Package Specification; ComponentLink3URL: http://www.analog.com/static/imported-files/packages/PKG_PDF/SOIC_Narrow%20(R)/R_8.pdf
U2 = AD8066AR: Double Channel Low Power Operational Amplifier, 145 MHz BW, 180 V/us SR, Industrial, 8-pin SOIC (R-8), Tube; Generic Part Number: AD8066; Manufacturer: Analog Devices; Amplifiers Per Package: 2; Input Bias Current: 2pA; Input Offset Voltage: 400uV; Iq/Amp: 7.4mA; Small Signal Bandwidth: 145MHz; V Span Max: 24V; V Span Min: 5V; DatasheetVersion: Rev. J; PackageVersion: 060506-A; PackageReference: R-8; PackageDescription: 8-Pin Standard Small Outline Package, Body 3.9 x 4.9 mm, Pitch 1.27 mm; Supplier 1: Digi-Key; Supplier Part Number 1: AD8066AR-ND; Slew Rate: 180V/us; Mounting Technology: Surface Mount; Code_JEDEC: MS-012-AA; PartNumber: AD8066AR; ComponentLink1Description: Manufacturer URL; ComponentLink1URL: http://www.analog.com/en/index.html; ComponentLink2Description: Datasheet; ComponentLink2URL: http://www.analog.com/static/imported-files/data_sheets/AD8065_8066.pdf; ComponentLink3Description: Package Specification; ComponentLink3URL: http://www.analog.com/static/imported-files/packages/PKG_PDF/SOIC_Narrow%20(R)/R_8.pdf; ComponentLink4Description: Reference Circuit; ComponentLink4URL: http://www.analog.com/en/all-operational-amplifiers-op-amps/operational-amplifiers-op-amps/ad8066/products/product.html#product-recommendations
U3 = AD9764ARZ: Imported; Manufacturer_Part_Number: AD9764ARZ; Vendor: Vendor; Value: Value; Type: Type; RefDes: Refdes

## Sheet ET-UARTPmod.SchDoc
size A4
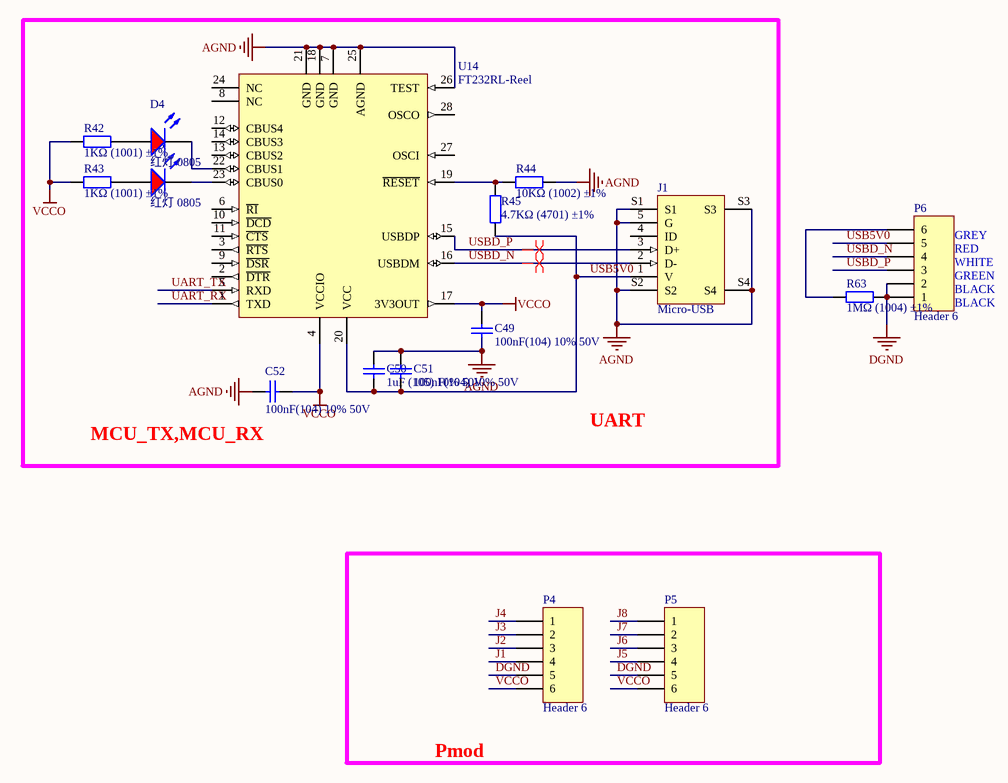
[diagram p4: ET-UARTPmod.SchDoc]

### Parts
C49  100nF(104) 10% 50V  [LC-0805_C]
C50  1uF (105) 10% 50V  [LC-0805_C]
C51  100nF(104) 10% 50V  [LC-0805_C]
C52  100nF(104) 10% 50V  [LC-0805_C]
D4  红灯 0805  [LC-0805_LED_S1]
D5  红灯 0805  [LC-0805_LED_S1]
J1  Micro-USB  [USB Micro AB]
P4  Header 6  [HDR1X6]
P5  Header 6  [HDR1X6]
P6  Header 6  [HDR1X6]
R42  1KΩ (1001) ±1%  [LC-0805_R]
R43  1KΩ (1001) ±1%  [LC-0805_R]
R44  10KΩ (1002) ±1%  [LC-0805_R]
R45  4.7KΩ (4701) ±1%  [LC-0805_R]
R63  1MΩ (1004) ±1%  [LC-0805_R]
U14  FT232RL-Reel  [SSOP-28_N]

### Blocks framed on the sheet
Pmod: P4 P5

### Nets
AGND: C49.2 C50.1 C51.1 C52.1 J1.5(G) J1.S1 J1.S2 J1.S3 J1.S4 R44.1 U14.7(GND) U14.18(GND) U14.21(GND) U14.25(AGND) U14.26(TEST)
DGND: P4.5 P5.5 P6.1 P6.2 R63.2
VCCO: C49.1 C52.2 P4.6 P5.6 R42.2 R43.2 U14.4(VCCIO) U14.17(3V3OUT)
J1: P4.4
J2: P4.3
J3: P4.2
J4: P4.1
J5: P5.4
J6: P5.3
J7: P5.2
J8: P5.1
UART_RX: U14.1(TXD)
UART_TX: U14.5(RXD)
USB5V0: C50.2 C51.2 J1.1(V) P6.5 R45.2 U14.20(VCC)
USBD_N: J1.2(D-) P6.4 U14.16(USBDM)
USBD_P: J1.3(D+) P6.3 U14.15(USBDP)
NetD4_A: D4.A R42.1
NetD4_K: D4.K U14.22(CBUS1)
NetD5_A: D5.A R43.1
NetD5_K: D5.K U14.23(CBUS0)
NetP6_6: P6.6 R63.1
NetR44_2: R44.2 R45.1 U14.19(~{RESET})

Not connected (* = marked no-connect by the designer): J1 4(ID); U14 2(~{DTR}) 3(~{RTS}) 6(~{RI}) 8(NC) 9(~{DSR}) 10(~{DCD}) 11(~{CTS}) 12(CBUS4) 13(CBUS2) 14(CBUS3) 24(NC) 27(OSCI) 28(OSCO)

### Layout directives
differential pair: USBD_N, USBD_P

### Notes on the sheet
- MCU_TX,MCU_RX
- UART
- Labels drawn without touching a wire or pin: BLACK, GREEN, GREY, RED, WHITE

### Library data of the parts
C49 C51 C52 = 0805 100nF(104) 10% 50V: 贴片电容; ComponentLink1Description: 供应商链接; ComponentLink1URL: http://www.szlcsc.com/product/details_50686.html; Package: 0805; Supplier: LC; SuppliersPartNumber: C49678
C50 = 0805 1uF (105) 10% 50V: 贴片电容; ComponentLink1Description: 供应商链接; ComponentLink1URL: http://www.szlcsc.com/product/details_29074.html; Package: 0805; Supplier: LC; SuppliersPartNumber: C28323
D4 D5 = 0805 红灯: 发光二极管; ComponentLink1Description: 供应商链接; ComponentLink1URL: http://www.szlcsc.com/product/details_2668.html; Package: 0805; Supplier: LC; SuppliersPartNumber: C2295
J1 = Micro-USB: USB 1.1, Right Angle, SMT, A Type, Receptacle, 4 Position, White; ContactMaterial: Copper Alloy; ContactPlating: Gold over Palladium Nickel; PCB_Layout: Complies with manufacturer's recommendation.; DrillSize: Corresponds to nominal value.; PanelGround: Without; Published: 15-Jul-2004; DatasheetDocument: 11-Apr-2003; PackageDocument: 11-Apr-2003; PackageReference: 353576; Publisher: Altium Limited; HousingMaterial: Thermoplastic; ComponentLink1Description: Manufacturer Link; ComponentLink1URL: http://www.tycoelectronics.com/; ComponentLink2Description: Packaging Specification; ComponentLink2URL: http://ecommas.tycoelectronics.com/commerce/DocumentDelivery/DDEController?Action=showdoc&DocId=Customer+Drawing%7F353576%7FD%7Ftif%7FJapanese%7FJPN_CD_353576_D.tif
P4-P6 = Header 6: Header, 6-Pin; LatestRevisionDate: 17-Jul-2002; LatestRevisionNote: Re-released for DXP Platform.; Publisher: Altium Limited
R42 R43 = 0805 1KΩ (1001) 1%: 贴片电阻; ComponentLink1Description: 供应商链接; ComponentLink1URL: http://www.szlcsc.com/product/details_18201.html; Package: 0805; Supplier: LC; SuppliersPartNumber: C17513
R44 = 0805 10KΩ (1002) 1%: 贴片电阻; ComponentLink1Description: 供应商链接; ComponentLink1URL: http://www.szlcsc.com/product/details_18102.html; Package: 0805; Supplier: LC; SuppliersPartNumber: C17414
R45 = 0805 4.7KΩ (4701) 1%: 贴片电阻; ComponentLink1Description: 供应商链接; ComponentLink1URL: http://www.szlcsc.com/product/details_18361.html; Package: 0805; Supplier: LC; SuppliersPartNumber: C17673
R63 = 0805 1MΩ (1004) 1%: 贴片电阻; ComponentLink1Description: 供应商链接; ComponentLink1URL: http://www.szlcsc.com/product/details_18202.html; Package: 0805; Supplier: LC; SuppliersPartNumber: C17514
U14 = FT232RL-Reel: USB UART Asynchronous Serial Data Transfer Chip, SSOP-28, Tape and Reel; Published: 19-Aug-2010; DatasheetVersion: ver 2.07, Jul-2010; PackageVersion: 2010; PackageReference: SSOP-28; Publisher: Altium Limited; PackageDescription: 28-Pin Small Outline Package 0.65 mm Pitch; ComponentLink1Description: Manufacturer Link; ComponentLink1URL: http://www.ftdichip.com/Products/ICs/FT232R.htm; ComponentLink2Description: Datasheet; ComponentLink2URL: http://www.ftdichip.com/Support/Documents/DataSheets/ICs/DS_FT232R.pdf

## Nets that join several sheets
+5V: ET-power (9 pins), ET-DAC (C5.2 U3.24)
+12V: ET-power (5 pins), ET-DAC (P2.2 U1.7 U2.8)
-12V: ET-power (5 pins), ET-DAC (P2.7 U1.4 U2.4)
AGND: ET-power (21 pins), ET-USB (8 pins), ET-DAC (12 pins), ET-UARTPmod (15 pins)
DGND: ET-power (33 pins), ET-FPGAIO (U6.3 U7.3), ET-USB (15 pins), ET-DAC (U3.15 U3.26), ET-UARTPmod (5 pins)
VCCO: ET-power (20 pins), ET-FPGAIO (U6.5 U7.5), ET-USB (17 pins), ET-DAC (U3.27), ET-UARTPmod (8 pins)
VE: ET-power (P10.A32 P10.B32 P10.C32), ET-DAC (P1.2)
~{INT0}: ET-FPGAIO (U5.101), ET-USB (U15.40)
~{INT1}: ET-FPGAIO (U5.100), ET-USB (U15.41)
~{SLCS}: ET-FPGAIO (U5.93), ET-USB (U15.47)
D0: ET-power (P10.C4), ET-FPGAIO (U5.39)
D1: ET-power (P10.A4), ET-FPGAIO (U5.38)
D2: ET-power (P10.C5), ET-FPGAIO (U5.35)
D3: ET-power (P10.A5), ET-FPGAIO (U5.34)
D4: ET-power (P10.C6), ET-FPGAIO (U5.33)
D5: ET-power (P10.A6), ET-FPGAIO (U5.32)
D6: ET-power (P10.C7), ET-FPGAIO (U5.30)
D7: ET-power (P10.A7), ET-FPGAIO (U5.29)
D8: ET-power (P10.C8), ET-FPGAIO (U5.27)
D9: ET-power (P10.A8), ET-FPGAIO (U5.26)
D10: ET-power (P10.C9), ET-FPGAIO (U5.24)
D11: ET-power (P10.A9), ET-FPGAIO (U5.23)
D12: ET-power (P10.C10), ET-FPGAIO (U5.22)
D13: ET-power (P10.A10), ET-FPGAIO (U5.21)
D14: ET-power (P10.C11), ET-FPGAIO (U5.17)
D15: ET-power (P10.A11), ET-FPGAIO (U5.16)
DACLK: ET-FPGAIO (U5.2), ET-DAC (U3.28)
DO0: ET-FPGAIO (U5.127), ET-DAC (U3.14)
DO1: ET-FPGAIO (U5.131), ET-DAC (U3.13)
DO2: ET-FPGAIO (U5.132), ET-DAC (U3.12)
DO3: ET-FPGAIO (U5.133), ET-DAC (U3.11)
DO4: ET-FPGAIO (U5.134), ET-DAC (U3.10)
DO5: ET-FPGAIO (U5.137), ET-DAC (U3.9)
DO6: ET-FPGAIO (U5.138), ET-DAC (U3.8)
DO7: ET-FPGAIO (U5.139), ET-DAC (U3.7)
DO8: ET-FPGAIO (U5.140), ET-DAC (U3.6)
DO9: ET-FPGAIO (U5.141), ET-DAC (U3.5)
DO10: ET-FPGAIO (U5.142), ET-DAC (U3.4)
DO11: ET-FPGAIO (U5.143), ET-DAC (U3.3)
DO12: ET-FPGAIO (U5.144), ET-DAC (U3.2)
DO13: ET-FPGAIO (U5.1), ET-DAC (U3.1)
FD0: ET-FPGAIO (U5.117), ET-USB (R52.4)
FD1: ET-FPGAIO (U5.118), ET-USB (R52.3)
FD2: ET-FPGAIO (U5.119), ET-USB (R52.2)
FD3: ET-FPGAIO (U5.120), ET-USB (R52.1)
FD4: ET-FPGAIO (U5.115), ET-USB (R54.1)
FD5: ET-FPGAIO (U5.114), ET-USB (R54.2)
FD6: ET-FPGAIO (U5.112), ET-USB (R54.3)
FD7: ET-FPGAIO (U5.111), ET-USB (R54.4)
FD8: ET-FPGAIO (U5.88), ET-USB (R58.1)
FD9: ET-FPGAIO (U5.87), ET-USB (R58.2)
FD10: ET-FPGAIO (U5.85), ET-USB (R58.3)
FD11: ET-FPGAIO (U5.84), ET-USB (R58.4)
FD12: ET-FPGAIO (U5.83), ET-USB (R62.1)
FD13: ET-FPGAIO (U5.80), ET-USB (R62.4)
FD14: ET-FPGAIO (U5.81), ET-USB (R62.3)
FD15: ET-FPGAIO (U5.82), ET-USB (R62.2)
FIFOAD0: ET-FPGAIO (U5.97), ET-USB (U15.44)
FIFOAD1: ET-FPGAIO (U5.95), ET-USB (U15.45)
FLAGA: ET-FPGAIO (U5.105), ET-USB (U15.36)
FLAGB: ET-FPGAIO (U5.104), ET-USB (U15.37)
FLAGC: ET-FPGAIO (U5.102), ET-USB (U15.38)
GCLK_N: ET-power (P10.C17), ET-FPGAIO (U7.4)
GCLK_P: ET-power (P10.C16), ET-FPGAIO (U6.4)
IFCLK: ET-FPGAIO (U5.116), ET-USB (U15.20)
J1: ET-FPGAIO (U5.40), ET-UARTPmod (P4.4)
J2: ET-FPGAIO (U5.41), ET-UARTPmod (P4.3)
J3: ET-FPGAIO (U5.43), ET-UARTPmod (P4.2)
J4: ET-FPGAIO (U5.44), ET-UARTPmod (P4.1)
J5: ET-FPGAIO (U5.45), ET-UARTPmod (P5.4)
J6: ET-FPGAIO (U5.46), ET-UARTPmod (P5.3)
J7: ET-FPGAIO (U5.47), ET-UARTPmod (P5.2)
J8: ET-FPGAIO (U5.48), ET-UARTPmod (P5.1)
PKTEND: ET-FPGAIO (U5.94), ET-USB (U15.46)
RDY0: ET-FPGAIO (U5.79), ET-USB (U15.8)
RDY1: ET-FPGAIO (U5.78), ET-USB (U15.9)
SLOE: ET-FPGAIO (U5.99), ET-USB (U15.42)
UART_RX: ET-FPGAIO (U5.75), ET-UARTPmod (U14.1)
UART_TX: ET-FPGAIO (U5.74), ET-UARTPmod (U14.5)
USB5V0: ET-USB (P7.5), ET-UARTPmod (6 pins)
WU2: ET-FPGAIO (U5.98), ET-USB (U15.43)